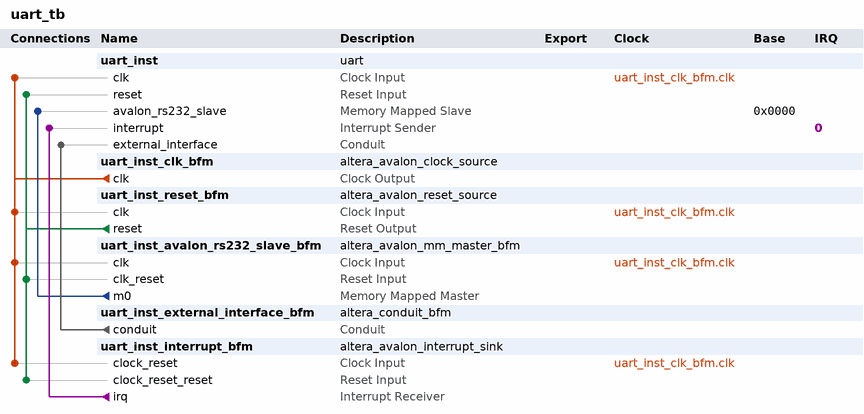
[diagram p0: system contents]
# Platform Designer (Qsys) system uart_tb, Cyclone IV E EP4CE30F23C7
# Parameters at their usual value, and those the tool derives, are not listed.
package require -exact qsys 15.1
create_system uart_tb
set_project_property DEVICE_FAMILY {Cyclone IV E}
set_project_property DEVICE EP4CE30F23C7

add_instance uart_inst uart 1.0

add_instance uart_inst_clk_bfm altera_avalon_clock_source 15.1

add_instance uart_inst_reset_bfm altera_avalon_reset_source 15.1
set_instance_parameter_value uart_inst_reset_bfm ASSERT_HIGH_RESET 1
set_instance_parameter_value uart_inst_reset_bfm INITIAL_RESET_CYCLES 50

add_instance uart_inst_avalon_rs232_slave_bfm altera_avalon_mm_master_bfm 15.1
set_instance_parameter_value uart_inst_avalon_rs232_slave_bfm ADDRESS_UNITS WORDS
set_instance_parameter_value uart_inst_avalon_rs232_slave_bfm AV_ADDRESS_W 1
set_instance_parameter_value uart_inst_avalon_rs232_slave_bfm AV_ALWAYS_BURST_MAX_BURST 0
set_instance_parameter_value uart_inst_avalon_rs232_slave_bfm AV_BURSTCOUNT_W 1
set_instance_parameter_value uart_inst_avalon_rs232_slave_bfm AV_BURST_BNDR_ONLY 0
set_instance_parameter_value uart_inst_avalon_rs232_slave_bfm AV_BURST_LINEWRAP 0
set_instance_parameter_value uart_inst_avalon_rs232_slave_bfm AV_CONSTANT_BURST_BEHAVIOR 1
set_instance_parameter_value uart_inst_avalon_rs232_slave_bfm AV_FIX_READ_LATENCY 1
set_instance_parameter_value uart_inst_avalon_rs232_slave_bfm AV_MAX_PENDING_WRITES 0
set_instance_parameter_value uart_inst_avalon_rs232_slave_bfm AV_NUMSYMBOLS 4
set_instance_parameter_value uart_inst_avalon_rs232_slave_bfm AV_READRESPONSE_W 1
set_instance_parameter_value uart_inst_avalon_rs232_slave_bfm AV_READ_WAIT_TIME 0
set_instance_parameter_value uart_inst_avalon_rs232_slave_bfm AV_WRITERESPONSE_W 1
set_instance_parameter_value uart_inst_avalon_rs232_slave_bfm USE_BURSTCOUNT 0
set_instance_parameter_value uart_inst_avalon_rs232_slave_bfm USE_BYTE_ENABLE 1
set_instance_parameter_value uart_inst_avalon_rs232_slave_bfm USE_READ 1
set_instance_parameter_value uart_inst_avalon_rs232_slave_bfm USE_READ_DATA 1
set_instance_parameter_value uart_inst_avalon_rs232_slave_bfm USE_READ_DATA_VALID 0
set_instance_parameter_value uart_inst_avalon_rs232_slave_bfm USE_WAIT_REQUEST 0
set_instance_parameter_value uart_inst_avalon_rs232_slave_bfm VHDL_ID 0

add_instance uart_inst_external_interface_bfm altera_conduit_bfm 15.1
set_instance_parameter_value uart_inst_external_interface_bfm CLOCKED_SIGNAL false
set_instance_parameter_value uart_inst_external_interface_bfm ENABLE_RESET false
set_instance_parameter_value uart_inst_external_interface_bfm SIGNAL_DIRECTIONS output,input
set_instance_parameter_value uart_inst_external_interface_bfm SIGNAL_ROLES RXD,TXD
set_instance_parameter_value uart_inst_external_interface_bfm SIGNAL_WIDTHS 1,1

add_instance uart_inst_interrupt_bfm altera_avalon_interrupt_sink 15.1
set_instance_parameter_value uart_inst_interrupt_bfm ASSERT_HIGH_IRQ 1
set_instance_parameter_value uart_inst_interrupt_bfm ASYNCHRONOUS_INTERRUPT 0
set_instance_parameter_value uart_inst_interrupt_bfm AV_IRQ_W 1
set_instance_parameter_value uart_inst_interrupt_bfm VHDL_ID 0

# connections
add_connection uart_inst_clk_bfm.clk uart_inst.clk clock
add_connection uart_inst_clk_bfm.clk uart_inst_avalon_rs232_slave_bfm.clk clock
add_connection uart_inst_clk_bfm.clk uart_inst_interrupt_bfm.clock_reset clock
add_connection uart_inst_clk_bfm.clk uart_inst_reset_bfm.clk clock
add_connection uart_inst_reset_bfm.reset uart_inst.reset reset
add_connection uart_inst_reset_bfm.reset uart_inst_avalon_rs232_slave_bfm.clk_reset reset
add_connection uart_inst_reset_bfm.reset uart_inst_interrupt_bfm.clock_reset_reset reset
add_connection uart_inst_avalon_rs232_slave_bfm.m0 uart_inst.avalon_rs232_slave avalon
set_connection_parameter_value uart_inst_avalon_rs232_slave_bfm.m0/uart_inst.avalon_rs232_slave baseAddress 0x0000
add_connection uart_inst_external_interface_bfm.conduit uart_inst.external_interface conduit
add_connection uart_inst_interrupt_bfm.irq uart_inst.interrupt interrupt
set_connection_parameter_value uart_inst_interrupt_bfm.irq/uart_inst.interrupt irqNumber 0

set_interconnect_requirement {$system} qsys_mm.clockCrossingAdapter HANDSHAKE
set_interconnect_requirement {$system} qsys_mm.enableEccProtection FALSE
set_interconnect_requirement {$system} qsys_mm.insertDefaultSlave FALSE
set_interconnect_requirement {$system} qsys_mm.maxAdditionalLatency 1

save_system uart_tb.qsys
